# Altium schematic sheet board1.SchDoc
size A; SheetNumber: 1; SheetTotal: 1
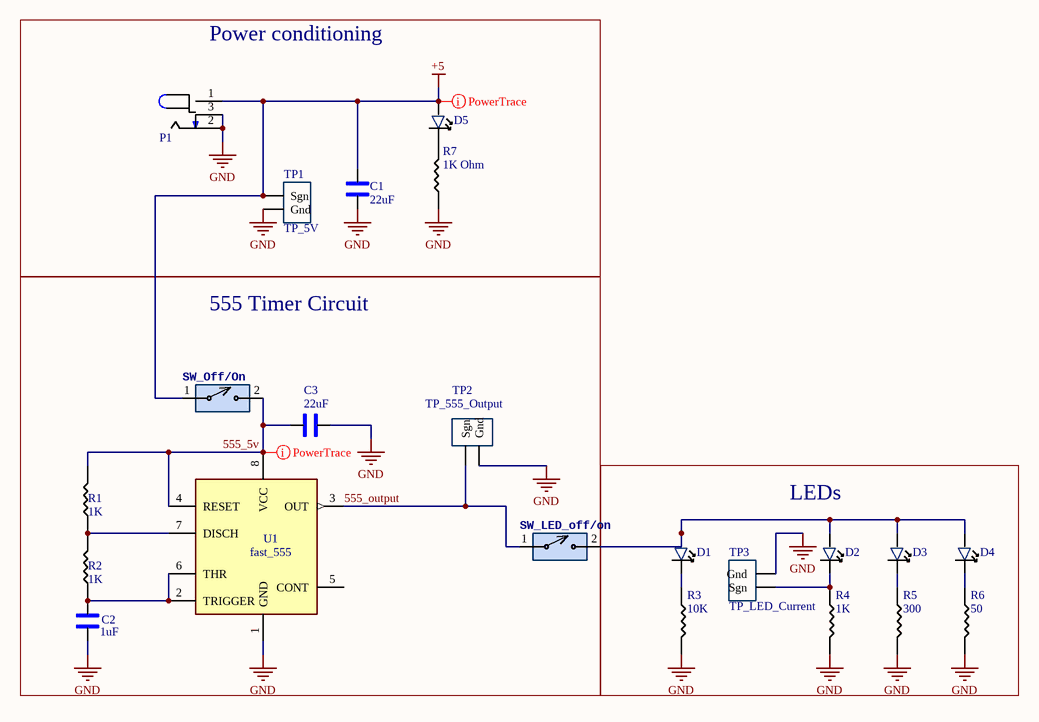
[diagram p0: board1.SchDoc]

## Parts
C1  22uF  [1206_Passive_Capacitor]
C2  1uF  [0402_Passive_Capacitor]
C3  22uF  [1206_Passive_Capacitor]
D1  (no value)  [LED_1206]
D2  (no value)  [LED_1206]
D3  (no value)  [LED_1206]
D4  Red  [LED_1206]  (value not drawn)
D5  Red  [LED_1206]  (value not drawn)
P1  Power Jack  [Power_Jack]  (value not drawn)
R1  1k  [1206_Passive_Resitor]
R2  1k  [1206_Passive_Resitor]
R3  value 10K  [1206_Passive_Resitor]  (hidden comment: 1M)
R4  1k  [1206_Passive_Resitor]
R5  value 300  [1206_Passive_Resitor]  (hidden comment: 300 Ohm)
R6  value 50  [1206_Passive_Resitor]  (hidden comment: 1k)
R7  value 1K Ohm  [1206_Passive_Resitor]  (hidden comment: 1k)
SW_LED_off/on  SW_2Pin_100mil_Switch  [2Pin-Header-Conn]  (value not drawn)
SW_Off/On  SW_2Pin_100mil_Switch  [2Pin-Header-Conn]  (value not drawn)
TP1  TP_5V  [TP10x_Probe]
TP2  TP_555_Output  [TP10x_Probe]
TP3  TP_LED_Current  [TP10x_Probe]
U1  fast_555  [TS555IDTTR]

## Blocks framed on the sheet
Power conditioning: C1 D5 P1 R7 TP1
555 Timer Circuit: C2 C3 R1 R2 SW_LED_off/on SW_Off/On TP2 U1
LEDs: D1-D4 R3-R6 TP3

## Nets
+5: C1.1 D5.1 P1.1 SW_Off/On.1 TP1.1(Sgn)
GND: C1.2 C2.2 C3.2 P1.2 P1.3 R3.2 R4.2 R5.2 R6.2 R7.1 TP1.2(Gnd) TP2.2(Gnd) TP3.2(Gnd) U1.1(GND)
555_5v: C3.1 R1.2 SW_Off/On.2 U1.4(RESET) U1.8(VCC)
555_output: SW_LED_off/on.1 TP2.1(Sgn) U1.3(OUT)
NetC2_1: C2.1 R2.1 U1.2(TRIGGER) U1.6(THR)
NetD1_1: D1.1 D2.1 D3.1 D4.1 SW_LED_off/on.2
NetD1_2: D1.2 R3.1
NetD2_2: D2.2 R4.1 TP3.1(Sgn)
NetD3_2: D3.2 R5.1
NetD4_2: D4.2 R6.1
NetD5_2: D5.2 R7.2
NetR1_1: R1.1 R2.2 U1.7(DISCH)

Not connected (* = marked no-connect by the designer): U1 5(CONT)

## Layout directives
rule Width Constraint [Pref Width = 20mil    Min Width = 10mil    Max Width = 100mil]: 555_5v, +5

## Library data of the parts
C1 C3 = C_22uF_1206: 22uF ±10% 25V X5R 1206 Multilayer Ceramic Capacitors MLCC - SMD/SMT RoHS; MFR Part #: CL31A226KAHNNNE; Type: basic; LCSC Part#: C12891; Datasheet: https://datasheet.lcsc.com/lcsc/1811031514_Samsung-Electro-Mechanics-CL31A226KAHNNNE_C12891.pdf; Value: 22uF
C2 = C_1uF_0402: MULTILAYER CERAMIC CAPACITORS MLCC - SMD/SMT 1UF 25V 0402 ROHS; MFR Part #: CL05A105KA5NQNC; Type: Basic; Datasheet: https://datasheet.lcsc.com/szlcsc/Samsung-Electro-Mechanics-CL05A105KA5NQNC_C52923.pdf; LCSC Part#: C52923; Value: 1uF
D1-D5 = LED_RED_1206: Red 621~631nm 1206 Light Emitting Diodes (LED) RoHS; MFR Part #: 15-21/R6C-FQ1R1B/2T; Type: Extended; LCSC Part#: C93133; Datasheet: https://datasheet.lcsc.com/szlcsc/1811151241_Everlight-Elec-15-21-R6C-FQ1R1B-2T_C93133.pdf
P1 = P_Power Jack: Power Barrel Connector Jack 2.10mm ID (0.083"), 5.50mm OD (0.217") Through Hole, Right Angle; MFR Part #: PJ-102A; Value: CONN PWR JACK 2X5.5MM SOLDER; Digikey Link: https://www.digikey.com/product-detail/en/PJ-102A/CP-102A-ND/275425/?itemSeq=304982367; LCSC Part#: C136744; Type: Extended
R1 R2 R4 R6 R7 = R_1K_1206: CHIP RESISTOR - SURFACE MOUNT 1KOHMS ±1% 1/4W 1206 ROHS; MFR Part #: RNCP1206FTD1K00CT; Digikey Link: https://www.digikey.com/product-detail/en/RNCP1206FTD1K00/RNCP1206FTD1K00CT-ND/2240675/?itemSeq=304982373; LCSC Part#: C4410; Type: Basic
  R1 R2 R4: Value: 1K
R3 = R_1M_1206: CHIP RESISTOR - SURFACE MOUNT 1MOHMS ±1% 1/4W 1206 ROHS; MFR Part #: RMCF1206JT1M00; Digikey Link: https://www.digikey.com/product-detail/en/RMCF1206JT1M00/RMCF1206JT1M00CT-ND/1942830/?itemSeq=304982358; LCSC Part#: C17927; Type: Basic
R5 = R_300Ohm_1206: CHIP RESISTOR - SURFACE MOUNT 300OHMS ±1% 1/4W 1206 ROHS; MFR Part #: 1206W4F3000T5E; Datasheet: https://datasheet.lcsc.com/szlcsc/Uniroyal-Elec-1206W4F3000T5E_C17887.pdf; LCSC Part#: C17887; Type: Basic
SW_LED_off/on SW_Off/On = SW_2Pin_100mil_Switch: 2Pin Header; LCSC Part#: C124375; Type: Extended
TP1-TP3 = TP_10x_Probe: Test Point 300 mil centers
U1 = U_555_Fast: 555 Type, Timer/Oscillator _Single_ IC 3MHz 8-SO; MFR Part #: LMC555CMX/NOPB; Package: SOIC-8; DigiKey link: https://www.digikey.com/product-detail/en/texas-instruments/LMC555CMX-NOPB/LMC555CMX-NOPBCT-ND/1010550; LCSC Part#: C90760; Type: Extended